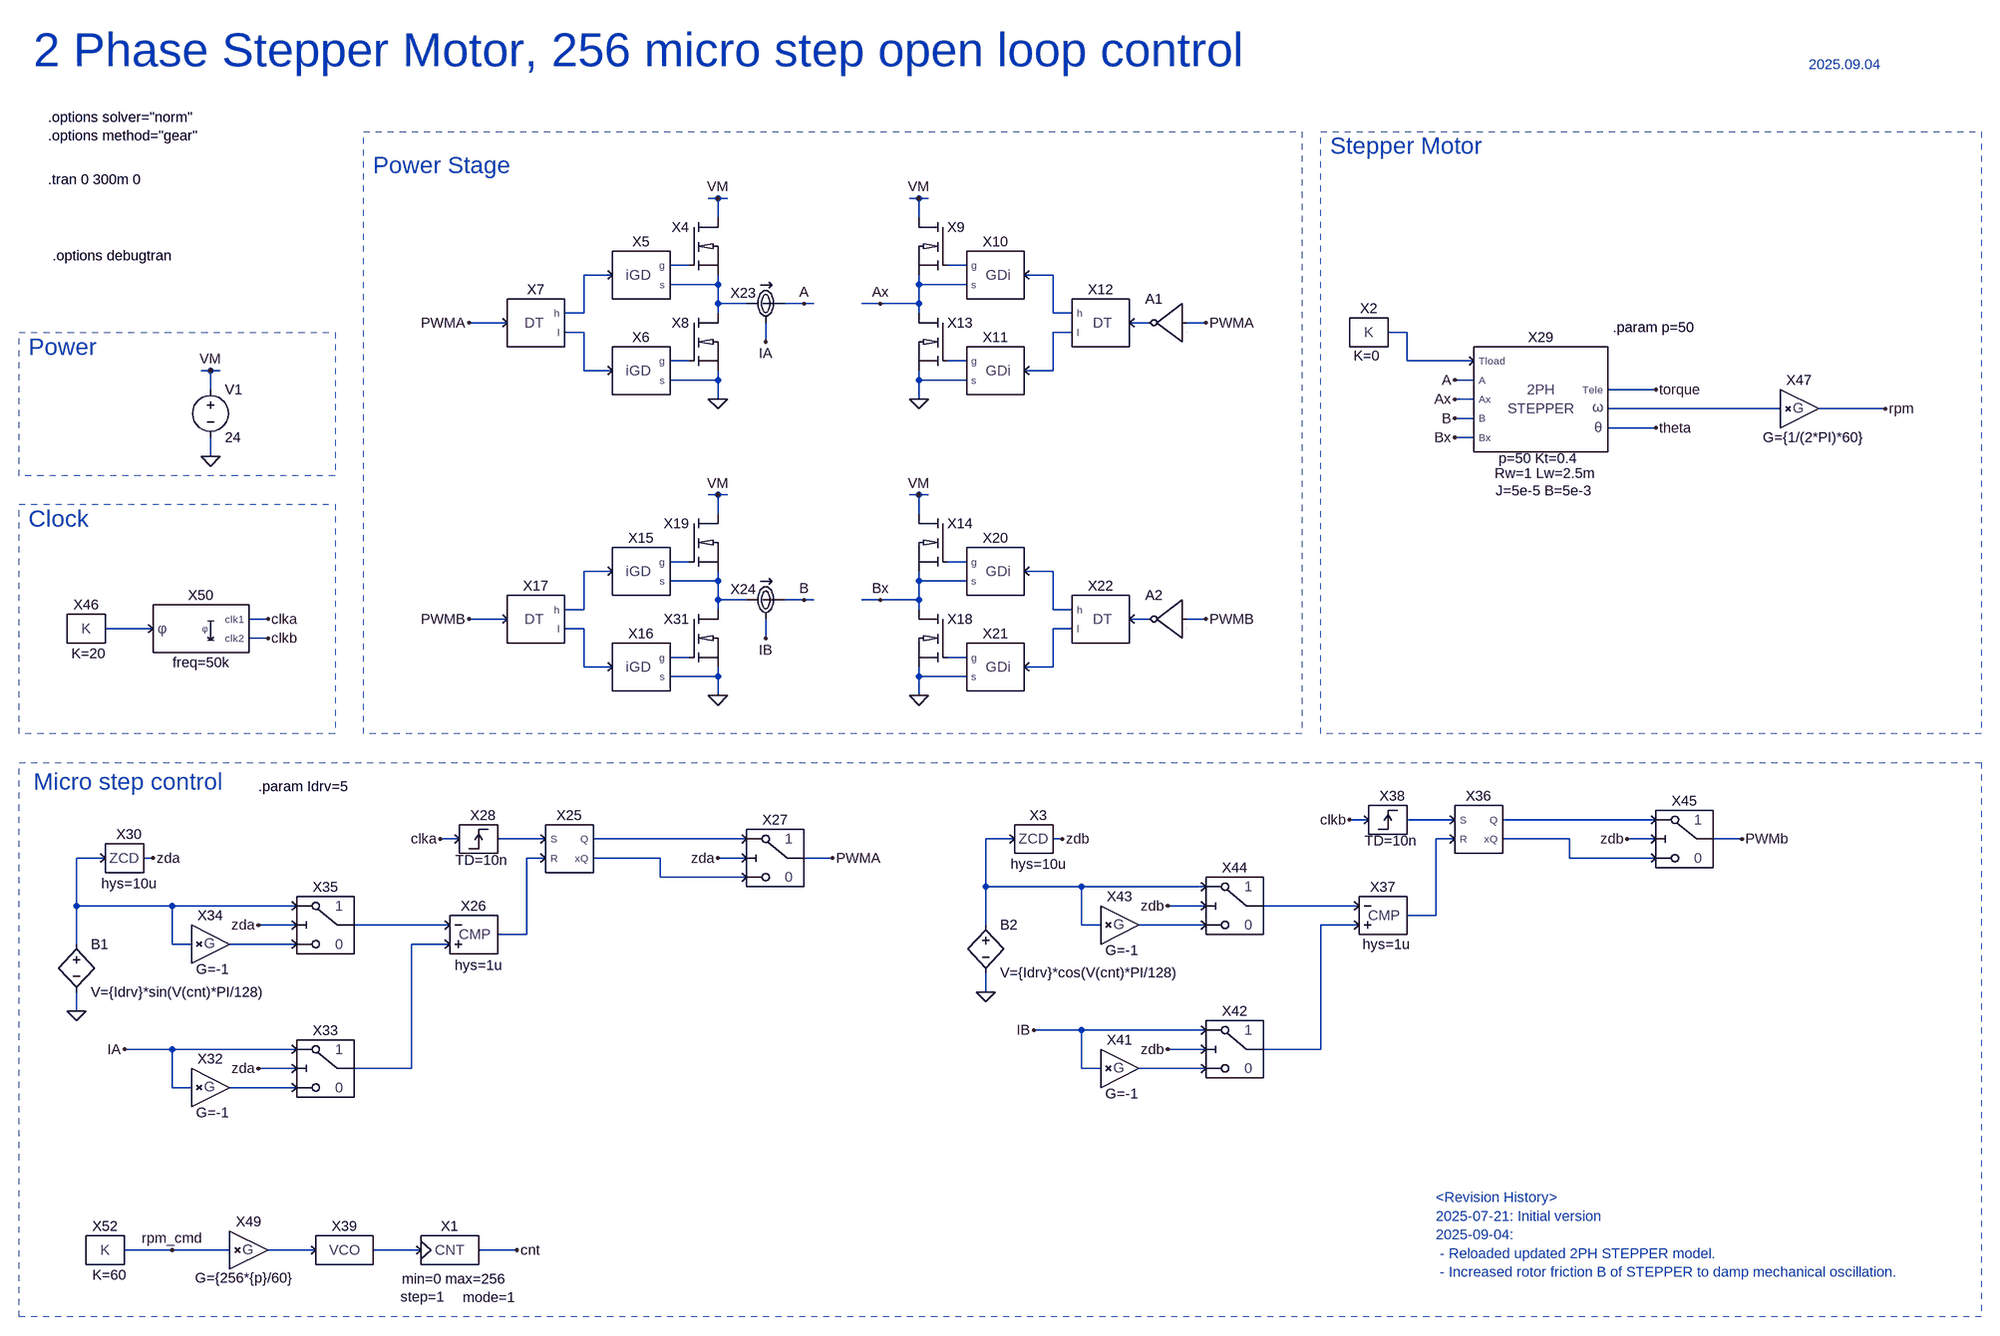
[diagram p0: schematic STEP2PH_uSTEP.asc]
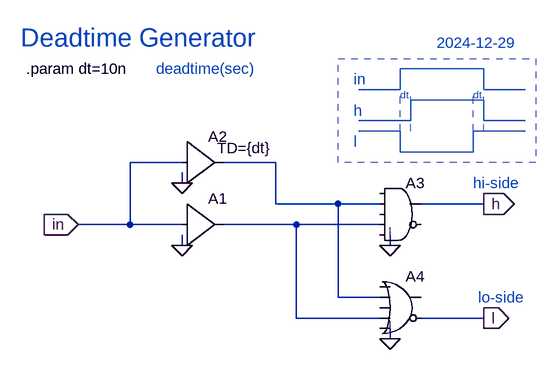
[diagram p1: sub-circuit deadtime.asc]
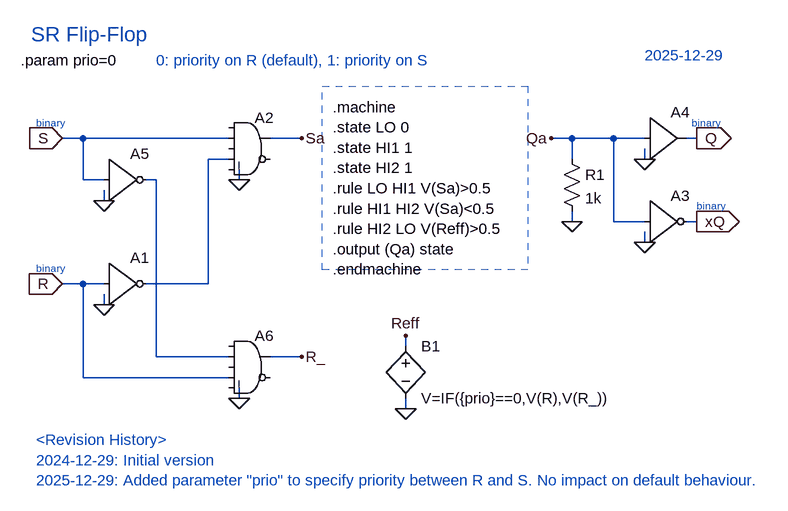
[diagram p2: sub-circuit srff.asc]
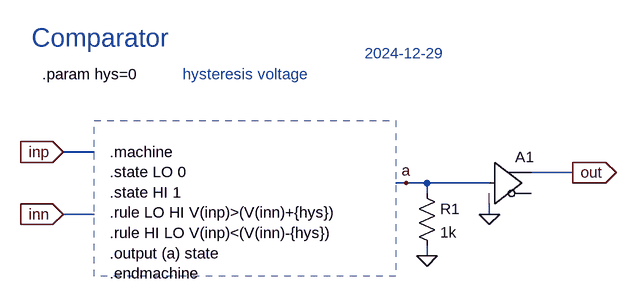
[diagram p3: sub-circuit cmp.asc]
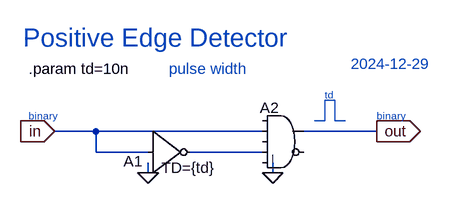
[diagram p4: sub-circuit posedge.asc]
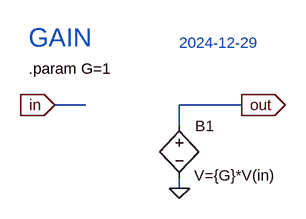
[diagram p5: sub-circuit gain.asc]
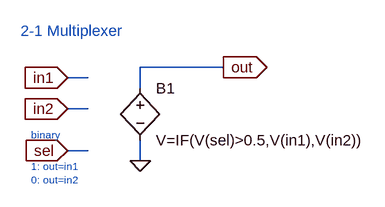
[diagram p6: sub-circuit mux.asc]
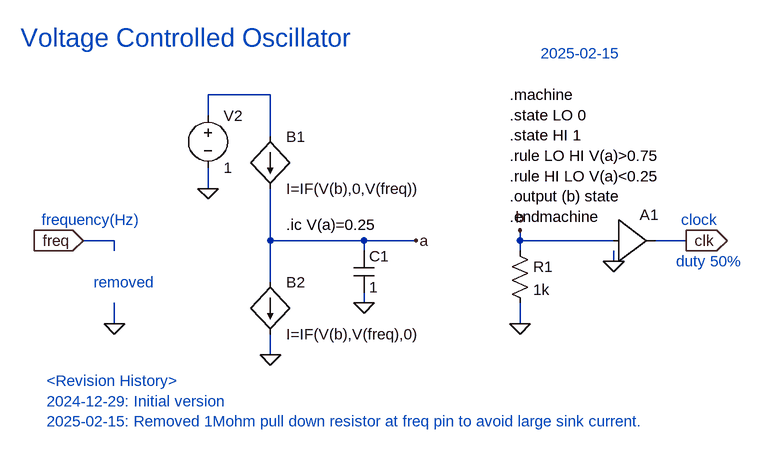
[diagram p7: sub-circuit vco.asc]
STEP2PH_uSTEP.asc, the LTspice schematic file:
Version 4.1
SHEET 1 1956 2284
WIRE -624 128 -640 128
WIRE -608 128 -624 128
WIRE -288 128 -304 128
WIRE -272 128 -288 128
WIRE -624 160 -624 128
WIRE -288 160 -288 128
WIRE -672 240 -704 240
WIRE -208 240 -240 240
WIRE -800 256 -848 256
WIRE -64 256 -112 256
WIRE -624 272 -624 256
WIRE -624 272 -704 272
WIRE -288 272 -288 256
WIRE -208 272 -288 272
WIRE -624 304 -624 272
WIRE -576 304 -624 304
WIRE -480 304 -512 304
WIRE -464 304 -480 304
WIRE -352 304 -384 304
WIRE -288 304 -288 272
WIRE -288 304 -352 304
WIRE -848 320 -848 256
WIRE -848 320 -880 320
WIRE -624 320 -624 304
WIRE -288 320 -288 304
WIRE -64 320 -64 256
WIRE -32 320 -64 320
WIRE -976 336 -1040 336
WIRE 96 336 64 336
WIRE 192 336 160 336
WIRE -848 352 -880 352
WIRE -32 352 -64 352
WIRE 528 352 496 352
WIRE -544 368 -544 336
WIRE -672 400 -704 400
WIRE -208 400 -240 400
WIRE 528 400 528 352
WIRE 640 400 528 400
WIRE -1472 416 -1488 416
WIRE -1456 416 -1472 416
WIRE -848 416 -848 352
WIRE -800 416 -848 416
WIRE -64 416 -64 352
WIRE -64 416 -112 416
WIRE -624 432 -624 416
WIRE -624 432 -704 432
WIRE -288 432 -288 416
WIRE -208 432 -288 432
WIRE 640 432 608 432
WIRE -1472 448 -1472 416
WIRE 944 448 864 448
WIRE -624 464 -624 432
WIRE -288 464 -288 432
WIRE 640 464 608 464
WIRE 1152 480 864 480
WIRE 1328 480 1216 480
WIRE 640 496 608 496
WIRE 944 512 864 512
WIRE 640 528 608 528
WIRE -1472 560 -1472 528
WIRE -624 624 -640 624
WIRE -608 624 -624 624
WIRE -288 624 -304 624
WIRE -272 624 -288 624
WIRE -624 656 -624 624
WIRE -288 656 -288 624
WIRE -672 736 -704 736
WIRE -208 736 -240 736
WIRE -800 752 -848 752
WIRE -64 752 -112 752
WIRE -624 768 -624 752
WIRE -624 768 -704 768
WIRE -288 768 -288 752
WIRE -208 768 -288 768
WIRE -624 800 -624 768
WIRE -576 800 -624 800
WIRE -480 800 -512 800
WIRE -464 800 -480 800
WIRE -352 800 -384 800
WIRE -288 800 -288 768
WIRE -288 800 -352 800
WIRE -848 816 -848 752
WIRE -848 816 -880 816
WIRE -624 816 -624 800
WIRE -288 816 -288 800
WIRE -64 816 -64 752
WIRE -32 816 -64 816
WIRE -1376 832 -1408 832
WIRE -976 832 -1040 832
WIRE 96 832 64 832
WIRE 192 832 160 832
WIRE -1568 848 -1648 848
WIRE -848 848 -880 848
WIRE -32 848 -64 848
WIRE -1376 864 -1408 864
WIRE -544 864 -544 832
WIRE -672 896 -704 896
WIRE -208 896 -240 896
WIRE -848 912 -848 848
WIRE -800 912 -848 912
WIRE -64 912 -64 848
WIRE -64 912 -112 912
WIRE -624 928 -624 912
WIRE -624 928 -704 928
WIRE -288 928 -288 912
WIRE -208 928 -288 928
WIRE -624 960 -624 928
WIRE -288 960 -288 928
WIRE 464 1168 432 1168
WIRE 608 1168 528 1168
WIRE 944 1168 688 1168
WIRE -1056 1200 -1088 1200
WIRE -912 1200 -992 1200
WIRE -576 1200 -832 1200
WIRE -128 1200 -176 1200
WIRE -48 1200 -64 1200
WIRE 608 1200 576 1200
WIRE 800 1200 688 1200
WIRE 944 1200 896 1200
WIRE 1088 1200 1040 1200
WIRE -1648 1232 -1696 1232
WIRE -1568 1232 -1584 1232
WIRE -912 1232 -944 1232
WIRE -720 1232 -832 1232
WIRE -576 1232 -624 1232
WIRE -432 1232 -480 1232
WIRE 800 1232 800 1200
WIRE 944 1232 800 1232
WIRE -720 1264 -720 1232
WIRE -576 1264 -720 1264
WIRE -176 1280 -176 1200
WIRE -16 1280 -176 1280
WIRE 192 1280 -16 1280
WIRE -1696 1312 -1696 1232
WIRE -1536 1312 -1696 1312
WIRE -1328 1312 -1536 1312
WIRE 192 1312 128 1312
WIRE 448 1312 288 1312
WIRE 576 1328 576 1200
WIRE 576 1328 528 1328
WIRE -1328 1344 -1392 1344
WIRE -1072 1344 -1232 1344
WIRE -176 1344 -176 1280
WIRE -16 1344 -16 1280
WIRE 16 1344 -16 1344
WIRE 192 1344 80 1344
WIRE 448 1344 384 1344
WIRE -944 1360 -944 1232
WIRE -944 1360 -992 1360
WIRE -1696 1376 -1696 1312
WIRE -1536 1376 -1536 1312
WIRE -1504 1376 -1536 1376
WIRE -1328 1376 -1440 1376
WIRE -1072 1376 -1136 1376
WIRE -176 1456 -176 1424
WIRE -1696 1488 -1696 1456
WIRE -16 1520 -96 1520
WIRE 192 1520 -16 1520
WIRE -1536 1552 -1616 1552
WIRE -1328 1552 -1536 1552
WIRE 192 1552 128 1552
WIRE 384 1552 384 1344
WIRE 384 1552 288 1552
WIRE -1328 1584 -1392 1584
WIRE -1136 1584 -1136 1376
WIRE -1136 1584 -1232 1584
WIRE -16 1584 -16 1520
WIRE 16 1584 -16 1584
WIRE 192 1584 80 1584
WIRE -1536 1616 -1536 1552
WIRE -1504 1616 -1536 1616
WIRE -1328 1616 -1440 1616
WIRE -1536 1888 -1616 1888
WIRE -1440 1888 -1536 1888
WIRE -1296 1888 -1376 1888
WIRE -1120 1888 -1200 1888
WIRE -960 1888 -1024 1888
FLAG 944 512 theta
FLAG -624 464 0
FLAG -480 304 A
FLAG 608 464 Ax
FLAG 608 528 Bx
FLAG -624 128 VM
FLAG -288 464 0
FLAG -352 304 Ax
FLAG -288 128 VM
FLAG -1040 336 PWMA
FLAG 192 336 PWMA
FLAG 944 448 torque
FLAG -624 960 0
FLAG -480 800 B
FLAG -624 624 VM
FLAG -288 960 0
FLAG -352 800 Bx
FLAG -288 624 VM
FLAG -1040 832 PWMB
FLAG 192 832 PWMB
FLAG -1472 560 0
FLAG -1472 416 VM
FLAG -544 368 IA
FLAG -544 864 IB
FLAG -1696 1488 0
FLAG -432 1232 PWMA
FLAG -1568 1232 zda
FLAG -1616 1552 IA
FLAG -1392 1584 zda
FLAG -1392 1344 zda
FLAG -1376 832 clka
FLAG -1088 1200 clka
FLAG -624 1232 zda
FLAG -176 1456 0
FLAG 1088 1200 PWMb
FLAG -48 1200 zdb
FLAG -96 1520 IB
FLAG 128 1552 zdb
FLAG 128 1312 zdb
FLAG 432 1168 clkb
FLAG 896 1200 zdb
FLAG -1376 864 clkb
FLAG -960 1888 cnt
FLAG 608 432 A
FLAG 608 496 B
FLAG -1536 1888 rpm_cmd
FLAG 1328 480 rpm
SYMBOL CONST 464 352 R0
WINDOW 39 -3 55 Bottom 2
SYMATTR SpiceLine K=0
SYMATTR InstName X2
SYMBOL iGD -752 256 R0
SYMATTR InstName X5
SYMBOL iGD -752 416 R0
SYMATTR InstName X6
SYMBOL DEADTIME -928 336 R0
SYMATTR InstName X7
SYMBOL iGD -160 256 M0
SYMATTR InstName X10
SYMBOL iGD -160 416 M0
SYMATTR InstName X11
SYMBOL DEADTIME 16 336 M0
SYMATTR InstName X12
SYMBOL Digital\\inv 160 272 M0
WINDOW 3 -21 103 Left 2
SYMATTR InstName A1
SYMBOL iGD -752 752 R0
SYMATTR InstName X15
SYMBOL iGD -752 912 R0
SYMATTR InstName X16
SYMBOL DEADTIME -928 832 R0
SYMATTR InstName X17
SYMBOL iGD -160 752 M0
SYMATTR InstName X20
SYMBOL iGD -160 912 M0
SYMATTR InstName X21
SYMBOL DEADTIME 16 832 M0
SYMATTR InstName X22
SYMBOL voltage -1472 432 R0
SYMATTR InstName V1
SYMATTR Value 24
SYMBOL IMON -544 304 R0
SYMATTR InstName X23
SYMBOL IMON -544 800 R0
SYMATTR InstName X24
SYMBOL SRFF -880 1216 R0
SYMATTR InstName X25
SYMBOL CMP -1024 1360 R0
WINDOW 39 0 67 Bottom 2
SYMATTR SpiceLine hys=1u
SYMATTR InstName X26
SYMBOL POSEDGE -1024 1200 R0
WINDOW 39 5 51 Bottom 2
SYMATTR SpiceLine TD=10n
SYMATTR InstName X28
SYMBOL GAIN -1472 1616 R0
WINDOW 39 3 58 Bottom 2
SYMATTR SpiceLine G=-1
SYMATTR InstName X32
SYMBOL MUX -1280 1584 R0
SYMATTR InstName X33
SYMBOL GAIN -1472 1376 R0
WINDOW 39 3 58 Bottom 2
SYMATTR SpiceLine G=-1
SYMATTR InstName X34
SYMBOL MUX -1280 1344 R0
SYMATTR InstName X35
SYMBOL MUX -528 1232 R0
SYMATTR InstName X27
SYMBOL SRFF 640 1184 R0
SYMATTR InstName X36
SYMBOL CMP 496 1328 R0
WINDOW 39 -3 64 Bottom 2
SYMATTR SpiceLine hys=1u
SYMATTR InstName X37
SYMBOL POSEDGE 496 1168 R0
WINDOW 39 5 51 Bottom 2
SYMATTR SpiceLine TD=10n
SYMATTR InstName X38
SYMBOL GAIN 48 1584 R0
WINDOW 39 3 58 Bottom 2
SYMATTR SpiceLine G=-1
SYMATTR InstName X41
SYMBOL MUX 240 1552 R0
SYMATTR InstName X42
SYMBOL GAIN 48 1344 R0
WINDOW 39 3 58 Bottom 2
SYMATTR SpiceLine G=-1
SYMATTR InstName X43
SYMBOL MUX 240 1312 R0
SYMATTR InstName X44
SYMBOL MUX 992 1200 R0
SYMATTR InstName X45
SYMBOL CONST -1680 848 R0
WINDOW 39 4 57 Bottom 2
SYMATTR SpiceLine K=20
SYMATTR InstName X46
SYMBOL bv -1696 1360 R0
SYMATTR InstName B1
SYMATTR Value V={Idrv}*sin(V(cnt)*PI/128)
SYMBOL bv -176 1328 R0
SYMATTR InstName B2
SYMATTR Value V={Idrv}*cos(V(cnt)*PI/128)
SYMBOL CONST -1648 1888 R0
WINDOW 39 7 57 Bottom 2
SYMATTR SpiceLine K=60
SYMATTR InstName X52
SYMBOL Digital\\inv 160 768 M0
WINDOW 3 -21 103 Left 2
SYMATTR InstName A2
SYMBOL VCO -1248 1888 R0
SYMATTR InstName X39
SYMBOL COUNTER -1072 1888 R0
WINDOW 123 7 64 Bottom 2
WINDOW 39 -46 94 Bottom 2
WINDOW 40 66 95 Bottom 2
SYMATTR InstName X1
SYMBOL GAIN 1184 480 R0
WINDOW 39 23 64 Bottom 2
SYMATTR SpiceLine G={1/(2*PI)*60}
SYMATTR InstName X47
SYMBOL GAIN -1408 1888 R0
WINDOW 39 -8 62 Bottom 2
SYMATTR SpiceLine G={256*{p}/60}
SYMATTR InstName X49
SYMBOL PHASESHIFT -1488 848 R0
WINDOW 39 0 72 Bottom 2
SYMATTR SpiceLine freq=50k
SYMATTR InstName X50
SYMBOL ZCD -1616 1232 R0
WINDOW 39 8 58 Bottom 2
SYMATTR SpiceLine hys=10u
SYMATTR InstName X30
SYMBOL ZCD -96 1200 R0
WINDOW 39 8 58 Bottom 2
SYMATTR SpiceLine hys=10u
SYMATTR InstName X3
SYMBOL iNMOS -624 208 R0
SYMATTR InstName X4
SYMBOL iNMOS -624 368 R0
SYMATTR InstName X8
SYMBOL iNMOS -288 208 M0
SYMATTR InstName X9
SYMBOL iNMOS -288 368 M0
SYMATTR InstName X13
SYMBOL iNMOS -288 704 M0
SYMATTR InstName X14
SYMBOL iNMOS -288 864 M0
SYMATTR InstName X18
SYMBOL iNMOS -624 704 R0
SYMATTR InstName X19
SYMBOL iNMOS -624 864 R0
SYMATTR InstName X31
SYMBOL STEPPER_2PH 752 464 R0
WINDOW 3 -5 115 Bottom 2
WINDOW 123 7 140 Bottom 2
WINDOW 39 5 169 Bottom 2
SYMATTR SpiceLine J=5e-5 B=5e-3
SYMATTR InstName X29
TEXT -1744 96 Left 2 !.tran 0 300m 0
TEXT -1744 -8 Left 2 !.options solver="norm"\n.options method="gear"
TEXT -1392 1112 Left 2 !.param Idrv=5
TEXT -1736 224 Left 2 !.options debugtran
TEXT 872 344 Left 2 !.param p=50
TEXT -1768 -120 Left 6 ;2 Phase Stepper Motor, 256 micro step open loop control
TEXT 400 40 Left 4 ;Stepper Motor
TEXT 1200 -96 Left 2 ;2025.09.04
TEXT -1200 72 Left 4 ;Power Stage
TEXT -1776 664 Left 4 ;Clock
TEXT -1776 376 Left 4 ;Power
TEXT -1768 1104 Left 4 ;Micro step control
TEXT 576 1800 Left 2 ;<Revision History>\n2025-07-21: Initial version\n2025-09-04: \n - Reloaded updated 2PH STEPPER model.\n - Increased rotor friction B of STEPPER to damp mechanical oscillation.
RECTANGLE Normal 352 1024 -1216 16 2
RECTANGLE Normal -1264 1024 -1792 640 2
RECTANGLE Normal 1488 1024 384 16 2
RECTANGLE Normal -1264 592 -1792 352 2
RECTANGLE Normal 1488 2000 -1792 1072 2

deadtime.asc, the sub-circuit schematic file:
Version 4
SHEET 1 1412 1312
WIRE 64 288 -16 288
WIRE 208 288 128 288
WIRE 64 320 64 304
WIRE 208 352 208 288
WIRE 304 352 208 352
WIRE 368 352 304 352
WIRE 528 352 432 352
WIRE -16 384 -16 288
WIRE -16 384 -96 384
WIRE 64 384 -16 384
WIRE 240 384 128 384
WIRE 368 384 240 384
WIRE 64 416 64 400
WIRE 384 416 384 400
WIRE 304 496 304 352
WIRE 368 496 304 496
WIRE 240 528 240 384
WIRE 368 528 240 528
WIRE 528 528 432 528
WIRE 384 560 384 544
FLAG -96 384 in
IOPIN -96 384 In
FLAG 64 416 0
FLAG 64 320 0
FLAG 384 416 0
FLAG 384 560 0
FLAG 528 352 h
IOPIN 528 352 Out
FLAG 528 528 l
IOPIN 528 528 Out
SYMBOL Digital\\buf1 64 320 R0
SYMATTR InstName A1
SYMBOL Digital\\buf1 64 224 R0
WINDOW 3 54 42 Left 2
SYMATTR Value TD={dt}
SYMATTR InstName A2
SYMBOL Digital\\and 400 304 R0
SYMATTR InstName A3
SYMBOL Digital\\or 400 448 R0
SYMATTR InstName A4
TEXT -176 144 Left 2 !.param dt=10n
TEXT -184 96 Left 4 ;Deadtime Generator
TEXT 24 144 Left 2 ;deadtime(sec)
TEXT 512 320 Left 2 ;hi-side
TEXT 520 496 Left 2 ;lo-side
TEXT 328 160 Left 2 ;in
TEXT 328 208 Left 2 ;h
TEXT 328 256 Left 2 ;l
TEXT 400 184 Left 1 ;dt
TEXT 512 184 Left 1 ;dt
TEXT 456 104 Left 2 ;2024-12-29
LINE Normal 400 176 336 176
LINE Normal 400 176 400 144
LINE Normal 528 144 400 144
LINE Normal 528 176 528 144
LINE Normal 592 176 528 176
LINE Normal 416 224 336 224
LINE Normal 416 224 416 192
LINE Normal 528 192 416 192
LINE Normal 528 224 528 192
LINE Normal 592 224 528 224
LINE Normal 400 240 336 240
LINE Normal 400 272 400 240
LINE Normal 512 272 400 272
LINE Normal 512 272 512 240
LINE Normal 592 240 512 240
LINE Normal 400 240 400 176 2
LINE Normal 512 240 512 176 2
LINE Normal 416 240 416 176 2
LINE Normal 528 240 528 176 2
RECTANGLE Normal 608 288 304 128 2

srff.asc, the sub-circuit schematic file:
Version 4.1
SHEET 1 928 680
WIRE -272 -496 -304 -496
WIRE -48 -496 -272 -496
WIRE 64 -496 16 -496
WIRE 480 -496 448 -496
WIRE 544 -496 480 -496
WIRE 592 -496 544 -496
WIRE 672 -496 656 -496
WIRE -48 -464 -80 -464
WIRE 480 -464 480 -496
WIRE 592 -464 592 -480
WIRE -272 -432 -272 -496
WIRE -240 -432 -272 -432
WIRE -160 -432 -176 -432
WIRE -32 -432 -32 -448
WIRE -240 -400 -240 -416
WIRE 480 -368 480 -384
WIRE 544 -368 544 -496
WIRE 592 -368 544 -368
WIRE 672 -368 656 -368
WIRE 592 -336 592 -352
WIRE -272 -272 -304 -272
WIRE -240 -272 -272 -272
WIRE -80 -272 -80 -464
WIRE -80 -272 -176 -272
WIRE -240 -240 -240 -256
WIRE 224 -176 224 -192
WIRE -160 -160 -160 -432
WIRE -48 -160 -160 -160
WIRE 64 -160 16 -160
WIRE -272 -128 -272 -272
WIRE -48 -128 -272 -128
WIRE -32 -96 -32 -112
WIRE 224 -80 224 -96
FLAG -304 -496 S
IOPIN -304 -496 In
FLAG -304 -272 R
IOPIN -304 -272 In
FLAG -240 -240 0
FLAG -32 -432 0
FLAG 64 -496 Sa
FLAG 592 -336 0
FLAG 672 -496 Q
IOPIN 672 -496 Out
FLAG 672 -368 xQ
IOPIN 672 -368 Out
FLAG 592 -464 0
FLAG 448 -496 Qa
FLAG 480 -368 0
FLAG 224 -80 0
FLAG 224 -192 Reff
FLAG -240 -400 0
FLAG -32 -96 0
FLAG 64 -160 R_
SYMBOL Digital\\inv -240 -336 R0
SYMATTR InstName A1
SYMBOL Digital\\and -16 -544 R0
SYMATTR InstName A2
SYMBOL Digital\\inv 592 -432 R0
SYMATTR InstName A3
SYMBOL Digital\\buf1 592 -560 R0
SYMATTR InstName A4
SYMBOL res 464 -480 R0
SYMATTR InstName R1
SYMATTR Value 1k
SYMBOL bv 224 -192 R0
SYMATTR InstName B1
SYMATTR Value V=IF({prio}==0,V(R),V(R_))
SYMBOL Digital\\inv -240 -496 R0
SYMATTR InstName A5
SYMBOL Digital\\and -16 -208 R0
SYMATTR InstName A6
TEXT 112 -544 Left 2 !.machine\n.state LO 0\n.state HI1 1\n.state HI2 1\n.rule LO HI1 V(Sa)>0.5\n.rule HI1 HI2 V(Sa)<0.5\n.rule HI2 LO V(Reff)>0.5\n.output (Qa) state\n.endmachine
TEXT -352 -656 Left 3 ;SR Flip-Flop
TEXT -344 -520 Left 1 ;binary
TEXT -344 -296 Left 1 ;binary
TEXT 664 -520 Left 1 ;binary
TEXT 672 -392 Left 1 ;binary
TEXT 592 -624 Left 2 ;2025-12-29
TEXT -368 -616 Left 2 !.param prio=0
TEXT -160 -616 Left 2 ;0: priority on R (default), 1: priority on S
TEXT -344 -32 Left 2 ;<Revision History>\n2024-12-29: Initial version\n2025-12-29: Added parameter "prio" to specify priority between R and S. No impact on default behaviour.
RECTANGLE Normal 412 -294 96 -576 2

cmp.asc, the sub-circuit schematic file:
Version 4
SHEET 1 1276 680
WIRE 352 96 304 96
WIRE 1088 128 1024 128
WIRE 832 144 816 144
WIRE 864 144 832 144
WIRE 960 144 864 144
WIRE 864 160 864 144
WIRE 352 192 304 192
WIRE 960 192 960 176
WIRE 864 256 864 240
FLAG 304 96 inp
IOPIN 304 96 In
FLAG 304 192 inn
IOPIN 304 192 In
FLAG 1088 128 out
IOPIN 1088 128 Out
FLAG 864 256 0
FLAG 832 144 a
FLAG 960 192 0
SYMBOL res 848 144 R0
SYMATTR InstName R1
SYMATTR Value 1k
SYMBOL Digital\\buf 960 80 R0
SYMATTR InstName A1
TEXT 376 96 Left 2 !.machine\n.state LO 0\n.state HI 1\n.rule LO HI V(inp)>(V(inn)+{hys})\n.rule HI LO V(inp)<(V(inn)-{hys})\n.output (a) state\n.endmachine
TEXT 272 -24 Left 2 !.param hys=0
TEXT 256 -80 Left 4 ;Comparator
TEXT 488 -24 Left 2 ;hysteresis voltage
TEXT 768 -56 Left 2 ;2024-12-29
RECTANGLE Normal 816 288 352 48 2

posedge.asc, the sub-circuit schematic file:
Version 4
SHEET 1 880 680
WIRE 192 160 128 160
WIRE 448 160 192 160
WIRE 624 160 512 160
WIRE 192 192 192 160
WIRE 272 192 192 192
WIRE 448 192 336 192
WIRE 272 224 272 208
WIRE 464 224 464 208
FLAG 128 160 in
IOPIN 128 160 In
FLAG 464 224 0
FLAG 624 160 out
IOPIN 624 160 Out
FLAG 272 224 0
SYMBOL Digital\\and 480 112 R0
WINDOW 0 -36 12 Left 2
SYMATTR InstName A2
SYMBOL Digital\\inv 272 128 R0
WINDOW 3 21 88 Left 2
WINDOW 0 -38 78 Left 2
SYMATTR Value TD={td}
SYMATTR InstName A1
TEXT 88 64 Left 2 !.param td=10n
TEXT 80 16 Left 4 ;Positive Edge Detector
TEXT 88 136 Left 1 ;binary
TEXT 624 136 Left 1 ;binary
TEXT 544 104 Left 1 ;td
TEXT 304 64 Left 2 ;pulse width
TEXT 584 56 Left 2 ;2024-12-29
LINE Normal 544 144 528 144
LINE Normal 544 144 544 112
LINE Normal 560 144 560 112
LINE Normal 576 144 560 144
LINE Normal 544 112 560 112

gain.asc, the sub-circuit schematic file:
Version 4
SHEET 1 880 680
WIRE 0 64 -48 64
WIRE 240 64 144 64
WIRE 144 96 144 64
WIRE 144 192 144 176
FLAG 144 192 0
FLAG 240 64 out
IOPIN 240 64 Out
FLAG -48 64 in
IOPIN -48 64 In
SYMBOL bv 144 80 R0
WINDOW 3 23 92 Left 2
SYMATTR Value V={G}*V(in)
SYMATTR InstName B1
TEXT -88 8 Left 2 !.param G=1
TEXT -88 -40 Left 4 ;GAIN
TEXT 144 -32 Left 2 ;2024-12-29

mux.asc, the sub-circuit schematic file:
Version 4
SHEET 1 880 680
WIRE 336 16 208 16
WIRE 128 32 96 32
WIRE 208 48 208 16
WIRE 128 80 96 80
WIRE 128 144 96 144
WIRE 208 160 208 128
FLAG 96 32 in1
IOPIN 96 32 In
FLAG 96 80 in2
IOPIN 96 80 In
FLAG 96 144 sel
IOPIN 96 144 In
FLAG 336 16 out
IOPIN 336 16 Out
FLAG 208 160 0
SYMBOL bv 208 32 R0
SYMATTR InstName B1
SYMATTR Value V=IF(V(sel)>0.5,V(in1),V(in2))
TEXT 24 -40 Left 2 ;2-1 Multiplexer
TEXT 40 120 Left 1 ;binary
TEXT 40 168 Left 1 ;1: out=in1\n0: out=in2

vco.asc, the sub-circuit schematic file:
Version 4
SHEET 1 1132 680
WIRE 176 -176 80 -176
WIRE 80 -144 80 -176
WIRE 176 -112 176 -176
WIRE 80 -32 80 -64
WIRE -64 48 -112 48
WIRE 176 48 176 -32
WIRE 320 48 176 48
WIRE 400 48 320 48
WIRE 560 48 560 32
WIRE 704 48 560 48
WIRE 816 48 768 48
WIRE -64 64 -64 48
WIRE 320 64 320 48
WIRE 560 64 560 48
WIRE 704 80 704 64
WIRE 176 112 176 48
WIRE 320 144 320 128
WIRE -64 176 -64 144
WIRE 560 176 560 144
WIRE 176 224 176 192
FLAG 320 144 0
FLAG 560 176 0
FLAG 176 224 0
FLAG 80 -32 0
FLAG 400 48 a
FLAG 560 32 b
FLAG 704 80 0
FLAG 816 48 clk
IOPIN 816 48 Out
FLAG -112 48 freq
IOPIN -112 48 In
FLAG -64 176 0
SYMBOL cap 304 64 R0
SYMATTR InstName C1
SYMATTR Value 1
SYMBOL res 544 48 R0
SYMATTR InstName R1
SYMATTR Value 1k
SYMBOL voltage 80 -160 R0
WINDOW 123 0 0 Left 0
WINDOW 39 0 0 Left 0
SYMATTR InstName V2
SYMATTR Value 1
SYMBOL bi 176 112 R0
SYMATTR InstName B2
SYMATTR Value I=IF(V(b),V(freq),0)
SYMBOL bi 176 -112 R0
SYMATTR InstName B1
SYMATTR Value I=IF(V(b),0,V(freq))
SYMBOL Digital\\buf1 704 -16 R0
SYMATTR InstName A1
TEXT 544 -176 Left 2 !.machine\n.state LO 0\n.state HI 1\n.rule LO HI V(a)>0.75\n.rule HI LO V(a)<0.25\n.output (b) state\n.endmachine
TEXT 200 24 Left 2 !.ic V(a)=0.25
TEXT -208 -264 Left 4 ;Voltage Controlled Oscillator
TEXT -176 16 Left 2 ;frequency(Hz)
TEXT 808 16 Left 2 ;clock
TEXT 800 80 Left 2 ;duty 50%
TEXT 592 -240 Left 2 ;2025-02-15
TEXT -168 264 Left 2 ;<Revision History>\n2024-12-29: Initial version\n2025-02-15: Removed 1Mohm pull down resistor at freq pin to avoid large sink current.
TEXT -96 112 Left 2 ;removed

counter.asc, the sub-circuit schematic file:
Version 4.1
SHEET 1 2588 2296
WIRE 160 304 112 304
WIRE 160 352 160 304
WIRE 208 352 160 352
WIRE 1088 368 448 368
WIRE -64 384 -112 384
WIRE 208 384 16 384
WIRE 352 384 304 384
WIRE -64 416 -208 416
WIRE 208 416 160 416
WIRE 160 464 160 416
WIRE 160 464 112 464
WIRE 352 480 352 384
WIRE 448 480 448 368
WIRE 320 512 272 512
WIRE 416 512 384 512
WIRE 656 512 480 512
WIRE 656 544 496 544
WIRE 800 544 752 544
WIRE 656 576 624 576
WIRE -208 656 -208 416
WIRE 368 656 -208 656
WIRE 496 656 496 544
WIRE 496 656 448 656
WIRE 624 672 624 576
WIRE 624 672 608 672
WIRE -208 688 -208 656
WIRE 368 688 304 688
WIRE 800 688 800 544
WIRE 832 688 800 688
WIRE 832 720 656 720
WIRE 992 720 928 720
WIRE 1088 720 1088 368
WIRE 1088 720 1056 720
WIRE 1200 720 1088 720
WIRE 832 752 800 752
WIRE -112 784 -112 384
WIRE 224 784 -112 784
WIRE 304 784 304 688
WIRE 304 784 288 784
WIRE 800 800 800 752
WIRE 800 800 784 800
WIRE -208 816 -208 768
WIRE -112 816 -112 784
WIRE 224 816 192 816
WIRE 192 864 192 816
WIRE 192 864 160 864
WIRE -112 944 -112 896
WIRE 448 944 352 944
WIRE 656 944 656 720
WIRE 656 944 528 944
WIRE 448 976 416 976
WIRE 352 1056 352 944
WIRE 352 1056 -704 1056
WIRE 1024 1056 1024 752
WIRE 1024 1056 352 1056
FLAG -704 1056 CLK
IOPIN -704 1056 In
FLAG 1200 720 out
IOPIN 1200 720 Out
FLAG -208 816 0
FLAG -112 944 0
FLAG 416 976 0
SYMBOL SAMPLEHOLD 1024 720 R0
SYMATTR InstName X1
SYMBOL CONST 240 512 R0
WINDOW 39 -3 55 Bottom 2
SYMATTR SpiceLine K={step}
SYMATTR InstName X2
SYMBOL SUM 448 512 M180
SYMATTR InstName X3
SYMBOL MUX 704 544 R0
SYMATTR InstName X4
SYMBOL CONST 576 672 R0
WINDOW 39 -3 55 Bottom 2
SYMATTR SpiceLine K={min}
SYMATTR InstName X5
SYMBOL bv -208 672 M0
WINDOW 3 25 92 Left 2
SYMATTR Value V=IF(V(out)<{min+step}*0.999,1,0)
SYMATTR InstName B1
SYMBOL bv -112 800 R0
WINDOW 0 -48 14 Left 2
WINDOW 3 -386 87 Left 2
SYMATTR InstName B2
SYMATTR Value V=IF(V(out)>{max}*0.999,1,0)
SYMBOL MUX 256 384 R0
SYMATTR InstName X7
SYMBOL MUL 352 512 M180
SYMATTR InstName X8
SYMBOL CONST 80 304 R0
WINDOW 39 -3 55 Bottom 2
SYMATTR SpiceLine K=-1
SYMATTR InstName X9
SYMBOL CONST 80 464 R0
WINDOW 39 -3 55 Bottom 2
SYMATTR InstName X10
SYMBOL SRFF -32 400 R0
SYMATTR InstName X11
SYMBOL SRFF 400 672 R0
SYMATTR InstName X6
SYMBOL Digital\\and 256 736 R0
SYMATTR InstName A1
SYMBOL CONST 128 864 R0
WINDOW 39 -3 55 Bottom 2
SYMATTR SpiceLine K={mode}
SYMATTR InstName X12
SYMBOL MUX 880 720 R0
SYMATTR InstName X13
SYMBOL CONST 752 800 R0
WINDOW 39 -3 55 Bottom 2
SYMATTR SpiceLine K={init}
SYMATTR InstName X14
SYMBOL SRFF 480 960 R0
SYMATTR InstName X15
TEXT -760 80 Left 2 !.param init=0\n.param min=0\n.param max=256\n.param step=1\n.param mode=1
TEXT -768 8 Left 6 ;Counter
TEXT 1152 48 Left 2 ;2025-07-21
TEXT 1080 784 Left 2 !.ic V(out)={init}
TEXT -496 80 Left 2 ;initial Value\nmin value\nmax value\ninvrement\n1: loopback 0: reverse
TEXT -768 1016 Left 2 ;Clock
TEXT -744 1136 Left 2 ;<Revision History>\n2025-07-21: Initial version

samplehold.asc, the sub-circuit schematic file:
Version 4
SHEET 1 880 680
WIRE 576 -560 480 -560
WIRE -80 -512 -128 -512
WIRE 480 -512 480 -560
WIRE 368 -496 368 -528
WIRE -80 -448 -128 -448
WIRE 368 -400 368 -416
WIRE 480 -400 480 -432
FLAG -128 -512 IN
IOPIN -128 -512 In
FLAG -128 -448 CLK
IOPIN -128 -448 In
FLAG 576 -560 OUT
IOPIN 576 -560 Out
FLAG 368 -400 0
FLAG 368 -528 o
FLAG 480 -400 0
SYMBOL res 352 -512 R0
SYMATTR InstName R1
SYMATTR Value 1k
SYMBOL bv 480 -528 R0
SYMATTR InstName B1
SYMATTR Value V=V(o)
TEXT -248 -672 Left 3 ;Sample & Hold
TEXT -248 -448 Left 1 ;binary
TEXT 496 -656 Left 2 ;2025-3-23
TEXT -24 -544 Left 2 !.machine\n.state LO 0\n.state LATCH 1\n.state HI 2\n.rule LO LATCH V(clk)>.5\n.rule LATCH HI  V(clk)>.9\n.rule * LO V(clk)<.5\n.output (o) IF((state==1),V(in),V(out))  \n.endmachine

sum.asc, the sub-circuit schematic file:
Version 4
SHEET 1 880 680
WIRE 288 96 208 96
WIRE 208 112 208 96
WIRE 96 128 48 128
WIRE 96 176 48 176
WIRE 208 208 208 192
FLAG 48 128 IN1
IOPIN 48 128 In
FLAG 48 176 IN2
IOPIN 48 176 In
FLAG 208 208 0
FLAG 288 96 OUT
IOPIN 288 96 Out
SYMBOL bv 208 96 R0
SYMATTR InstName B1
SYMATTR Value V=V(IN1)+V(IN2)
TEXT -16 32 Left 4 ;SUM
TEXT 200 40 Left 2 ;2024-12-29

mul.asc, the sub-circuit schematic file:
Version 4
SHEET 1 880 680
WIRE 96 48 48 48
WIRE 320 48 240 48
WIRE 96 64 96 48
WIRE 240 64 240 48
WIRE 96 160 96 144
WIRE 240 160 240 144
WIRE 96 208 48 208
WIRE 96 224 96 208
WIRE 96 320 96 304
FLAG 48 48 IN1
IOPIN 48 48 In
FLAG 48 208 IN2
IOPIN 48 208 In
FLAG 240 160 0
FLAG 320 48 OUT
IOPIN 320 48 Out
FLAG 96 160 0
FLAG 96 320 0
SYMBOL bv 240 48 R0
SYMATTR InstName B1
SYMATTR Value V=V(IN1)*V(IN2)
SYMBOL res 80 48 R0
SYMATTR InstName R1
SYMATTR Value 1Meg
SYMBOL res 80 208 R0
SYMATTR InstName R2
SYMATTR Value 1Meg
TEXT -16 -56 Left 4 ;Multiplier

stepper_2ph.asc, the sub-circuit schematic file:
Version 4.1
SHEET 1 2756 2296
WIRE 1808 256 1712 256
WIRE 1712 304 1712 256
WIRE 1712 416 1712 384
WIRE 1808 496 1712 496
WIRE 1344 512 1264 512
WIRE 1712 544 1712 496
WIRE 48 640 -64 640
WIRE 192 640 128 640
WIRE 400 640 272 640
WIRE 1712 656 1712 624
WIRE 400 672 400 640
WIRE 2432 768 2272 768
WIRE 400 800 400 752
WIRE 400 800 -64 800
WIRE 2272 832 2272 768
WIRE 2432 864 2432 768
WIRE 1328 944 1216 944
WIRE 1472 944 1408 944
WIRE 1664 944 1552 944
WIRE 1856 944 1744 944
WIRE 64 960 -48 960
WIRE 208 960 144 960
WIRE 416 960 288 960
WIRE 2272 976 2272 912
WIRE 2432 976 2272 976
WIRE 416 992 416 960
WIRE 1216 992 1216 944
WIRE 1744 992 1744 944
WIRE 2272 1008 2272 976
WIRE 1216 1104 1216 1072
WIRE 1664 1104 1664 944
WIRE 1744 1104 1744 1072
WIRE 416 1120 416 1072
WIRE 416 1120 -48 1120
WIRE 2272 1120 2272 1072
FLAG 1712 656 0
FLAG 1216 1104 0
FLAG 2272 1120 0
FLAG 1264 512 Tload
IOPIN 1264 512 In
FLAG -64 640 A
IOPIN -64 640 BiDir
FLAG -64 800 Ax
IOPIN -64 800 BiDir
FLAG -48 960 B
IOPIN -48 960 BiDir
FLAG -48 1120 Bx
IOPIN -48 1120 BiDir
FLAG 2432 976 theta
IOPIN 2432 976 Out
FLAG 1808 496 Tcog
IOPIN 1808 496 Out
FLAG 1664 1104 0
FLAG 2432 864 0
FLAG 1712 416 0
FLAG 1808 256 Tele
IOPIN 1808 256 Out
FLAG 1744 1104 0
FLAG 1856 944 omega
IOPIN 1856 944 Out
SYMBOL res 144 624 R90
WINDOW 0 0 56 VBottom 2
WINDOW 3 32 56 VTop 2
SYMATTR InstName Ra
SYMATTR Value {Rw}
SYMBOL ind 176 656 R270
WINDOW 0 32 56 VTop 2
WINDOW 3 5 56 VBottom 2
SYMATTR InstName La
SYMATTR Value {Lw}
SYMBOL res 160 944 R90
WINDOW 0 0 56 VBottom 2
WINDOW 3 32 56 VTop 2
SYMATTR InstName Rb
SYMATTR Value {Rw}
SYMBOL ind 192 976 R270
WINDOW 0 32 56 VTop 2
WINDOW 3 5 56 VBottom 2
SYMATTR InstName Lb
SYMATTR Value {Lw}
SYMBOL bv 416 976 R0
WINDOW 3 41 53 Left 2
SYMATTR Value V={Kt*cos(p*V(theta))*V(omega)}
SYMATTR InstName B2
SYMBOL bv 1712 528 R0
SYMATTR InstName B3
SYMATTR Value V={cg1*Kt*sin(N*V(theta))+cg3*Kt*sin(3*N*V(theta))+cg5*Kt*sin(5*N*V(theta))}
SYMBOL ind 1456 960 R270
WINDOW 0 32 56 VTop 2
WINDOW 3 5 56 VBottom 2
SYMATTR InstName J
SYMATTR Value {J}
SYMBOL bv 1216 976 R0
SYMATTR InstName B5
SYMATTR Value V=V(Tele)-V(Tload)+V(Tcog)
SYMBOL cap 2256 1008 R0
SYMATTR InstName C1
SYMATTR Value 1
SYMBOL res 1424 928 R90
WINDOW 0 0 56 VBottom 2
WINDOW 3 32 56 VTop 2
SYMATTR InstName B
SYMATTR Value {B}
SYMBOL bi 2272 832 R0
SYMATTR InstName B4
SYMATTR Value I=V(omega)
SYMBOL bv 400 656 R0
WINDOW 3 41 53 Left 2
SYMATTR Value V={Kt*sin(p*V(theta))*V(omega)}
SYMATTR InstName B1
SYMBOL bv 1712 288 R0
SYMATTR InstName B6
SYMATTR Value V={Kt*I(La)*sin(p*V(theta))+Kt*I(Lb)*cos(p*V(theta))}
SYMBOL bv 1744 976 R0
SYMATTR InstName B7
SYMATTR Value V=I(J)
TEXT -104 144 Left 2 !.param p=50\n.param Rw=1\n.param Lw=2.5m\n.param J=5e-5\n.param B=5e-4\n.param Kt=0.4\n.param N=100\n.param cg1=0.01\n.param cg3=0.003\n.param cg5=0.001
TEXT -128 40 Left 6 ;Two Phase Hybrid Stepper Motor
TEXT 2440 56 Left 2 ;2025-09-04
TEXT 2384 1056 Left 2 !.ic V(theta)=0
TEXT 1480 832 Left 2 !.ic I(J)=0
TEXT 1480 880 Left 2 ;Inertia
TEXT 1328 880 Left 2 ;Friction
TEXT 288 496 Left 2 !.ic I(La)=0\n.ic I(Lb)=0
TEXT 120 144 Left 2 ;Number of rotor pole pairs\nWiding Resistance (ohm)\nWiding inductance (H)\nRotor Inertia (kg・m^2)\nRotor Friction (N・m・s/rad)\nTorque Constant (N・m/A)\nCogging per rotation (least common multiple of 2*p and number of stator slots)\n1st harmonic cogging torque ratio  (cogging torque amplitude divided by Kt)\n3rd harmonic cogging torque ratio  (cogging torque amplitude divided by Kt)\n5th harmonic cogging torque ratio  (cogging torque amplitude divided by Kt)
TEXT -120 1216 Left 2 ;<Revision History>\n2025-07-19: Initial version\n2025-09-04: \n  - Fixed mistake ini cogging torque formula.\n  - Replaced all IMON BV source.\n  - Reduced default cogging torque ration.
TEXT -144 480 Left 4 ;Electrical Domain
TEXT 1112 232 Left 4 ;Mechanical Domain
RECTANGLE Normal 1024 1184 -160 448 2
RECTANGLE Normal 2752 1184 1088 192 2

The netlist it stands for:
* STEP2PH_uSTEP.asc
X§X2 N009 CONST K=0  ; pins K
X§X5 N003 N001 N005 iGD  ; pins in g s
X§X6 N007 N010 0 iGD  ; pins in g s
X§X7 PWMA N007 N003 deadtime params: dt=10n
X§X10 N004 N002 Ax iGD  ; pins in g s
X§X11 N008 N011 0 iGD  ; pins in g s
X§X12 N006 N008 N004 deadtime params: dt=10n
A1 PWMA 0 0 0 0 N006 0 0 BUF
X§X15 N015 N013 N017 iGD  ; pins in g s
X§X16 N020 N022 0 iGD  ; pins in g s
X§X17 PWMB N020 N015 deadtime params: dt=10n
X§X20 N016 N014 Bx iGD  ; pins in g s
X§X21 N021 N023 0 iGD  ; pins in g s
X§X22 N018 N021 N016 deadtime params: dt=10n
V1 VM 0 24
X§X23 A IA N005 IMON rsns=10u  ; pins n out p
X§X24 B IB N017 IMON rsns=10u  ; pins n out p
X§X25 N032 N026 N027 N033 srff params: prio=0
X§X26 N035 N039 N032 cmp params: hys=1u
X§X28 clka N026 posedge params: TD=10n
X§X32 IA N041 gain params: G=-1
X§X33 IA N041 zda N039 mux
X§X34 N031 N038 gain params: G=-1
X§X35 N031 N038 zda N035 mux
X§X27 N027 N033 zda PWMA mux
X§X36 N029 N024 N025 N030 srff params: prio=0
X§X37 N034 N037 N029 cmp params: hys=1u
X§X38 clkb N024 posedge params: TD=10n
X§X41 IB N040 gain params: G=-1
X§X42 IB N040 zdb N037 mux
X§X43 N028 N036 gain params: G=-1
X§X44 N028 N036 zdb N034 mux
X§X45 N025 N030 zdb PWMB mux
X§X46 N019 CONST K=20  ; pins K
B1 N031 0 V={Idrv}*sin(V(cnt)*PI/128)
B2 N028 0 V={Idrv}*cos(V(cnt)*PI/128)
X§X52 rpm_cmd CONST K=60  ; pins K
A2 PWMB 0 0 0 0 N018 0 0 BUF
X§X39 N042 N043 vco
X§X1 N043 cnt counter params: init=0 min=0 max=256 step=1 mode=1
X§X47 N012 rpm gain params: G={1/(2*PI)*60}
X§X49 rpm_cmd N042 gain params: G={256*{p}/60}
X§X50 N019 clka clkb PHASESHIFT freq=50k  ; pins phase clk1 clk2
X§X30 N031 zda ZCD params: hys=10u  ; pins in zcd
X§X3 N028 zdb ZCD params: hys=10u  ; pins in zcd
X§X4 VM N001 N005 iNMOS params: esl=1f rsnb=1k csnb=10p ron=10m  ; pins D G S
X§X8 N005 N010 0 iNMOS params: esl=1f rsnb=1k csnb=10p ron=10m  ; pins D G S
X§X9 VM N002 Ax iNMOS params: esl=1f rsnb=1k csnb=10p ron=10m  ; pins D G S
X§X13 Ax N011 0 iNMOS params: esl=1f rsnb=1k csnb=10p ron=10m  ; pins D G S
X§X14 VM N014 Bx iNMOS params: esl=1f rsnb=1k csnb=10p ron=10m  ; pins D G S
X§X18 Bx N023 0 iNMOS params: esl=1f rsnb=1k csnb=10p ron=10m  ; pins D G S
X§X19 VM N013 N017 iNMOS params: esl=1f rsnb=1k csnb=10p ron=10m  ; pins D G S
X§X31 N017 N022 0 iNMOS params: esl=1f rsnb=1k csnb=10p ron=10m  ; pins D G S
X§X29 N009 A Ax B Bx N012 torque theta stepper_2ph params: p=50 Kt=0.4 Rw=1 Lw=2.5m J=5e-5 B=5e-3 N=100 cg1=0.05 cg3=0.015 cg5=0.005

* block symbol definitions
.subckt deadtime in l h
A1 in 0 0 0 0 0 N002 0 BUF
A2 in 0 0 0 0 0 N001 0 BUF TD={dt}
A3 0 N001 0 N002 0 0 h 0 AND
A4 0 N001 0 N002 0 l 0 0 OR
.param dt=10n
* Deadtime Generator
* deadtime(sec)
* hi-side
* lo-side
* in
* h
* l
* dt
* dt
* 2024-12-29
.ends deadtime

.subckt srff R S Q xQ
A1 R 0 0 0 0 N001 0 0 BUF
A2 0 S 0 N001 0 0 Sa 0 AND
A3 Qa 0 0 0 0 xQ 0 0 BUF
A4 Qa 0 0 0 0 0 Q 0 BUF
R1 Qa 0 1k
B1 Reff 0 V=IF({prio}==0,V(R),V(R_))
A5 S 0 0 0 0 N002 0 0 BUF
A6 0 N002 0 R 0 0 R_ 0 AND
.machine
.state LO 0
.state HI1 1
.state HI2 1
.rule LO HI1 V(Sa)>0.5
.rule HI1 HI2 V(Sa)<0.5
.rule HI2 LO V(Reff)>0.5
.output (Qa) state
.endmachine
* SR Flip-Flop
* binary
* binary
* binary
* binary
* 2025-12-29
.param prio=0
* 0: priority on R (default), 1: priority on S
* <Revision History>
* 2024-12-29: Initial version
* 2025-12-29: Added parameter "prio" to specify priority between R and S. No impact on default behaviour.
.ends srff

.subckt cmp inn inp out
R1 a 0 1k
A1 a 0 0 0 0 0 out 0 BUF
.machine
.state LO 0
.state HI 1
.rule LO HI V(inp)>(V(inn)+{hys})
.rule HI LO V(inp)<(V(inn)-{hys})
.output (a) state
.endmachine
.param hys=0
* Comparator
* hysteresis voltage
* 2024-12-29
.ends cmp

.subckt posedge in out
A2 0 in 0 N001 0 0 out 0 AND
A1 in 0 0 0 0 N001 0 0 BUF TD={td}
.param td=10n
* Positive Edge Detector
* binary
* binary
* td
* pulse width
* 2024-12-29
.ends posedge

.subckt gain in out
B1 out 0 V={G}*V(in)
.param G=1
* GAIN
* 2024-12-29
.ends gain

.subckt mux in1 in2 sel out
B1 out 0 V=IF(V(sel)>0.5,V(in1),V(in2))
* 2-1 Multiplexer
* binary
* 1: out=in1
* 0: out=in2
.ends mux

.subckt vco freq clk
C1 a 0 1
R1 b 0 1k
V2 N001 0 1
B2 a 0 I=IF(V(b),V(freq),0)
B1 N001 a I=IF(V(b),0,V(freq))
A1 b 0 0 0 0 0 clk 0 BUF
.machine
.state LO 0
.state HI 1
.rule LO HI V(a)>0.75
.rule HI LO V(a)<0.25
.output (b) state
.endmachine
.ic V(a)=0.25
* Voltage Controlled Oscillator
* frequency(Hz)
* clock
* duty 50%
* 2025-02-15
* <Revision History>
* 2024-12-29: Initial version
* 2025-02-15: Removed 1Mohm pull down resistor at freq pin to avoid large sink current.
* removed
.ends vco

.subckt counter CLK out
X§X1 CLK N015 out samplehold
X§X2 N007 CONST K={step}  ; pins K
X§X3 N008 out N009 sum
X§X4 N009 N012 N010 N011 mux
X§X5 N012 CONST K={min}  ; pins K
B1 N005 0 V=IF(V(out)<{min+step}*0.999,1,0)
B2 N002 0 V=IF(V(out)>{max}*0.999,1,0)
X§X7 N001 N006 N003 N004 mux
X§X8 N007 N004 N008 mul
X§X9 N001 CONST K=-1  ; pins K
X§X10 N006 CONST K=1  ; pins K
X§X11 N005 N002 N003 NC_01 srff params: prio=0
X§X6 N013 N005 N010 NC_02 srff params: prio=0
A1 0 N002 0 N017 0 0 N013 0 AND
X§X12 N017 CONST K={mode}  ; pins K
X§X13 N011 N016 N014 N015 mux
X§X14 N016 CONST K={init}  ; pins K
X§X15 0 CLK N014 NC_03 srff params: prio=0
.param init=0
.param min=0
.param max=256
.param step=1
.param mode=1
* Counter
* 2025-07-21
.ic V(out)={init}
* initial Value
* min value
* max value
* invrement
* 1: loopback 0: reverse
* Clock
* <Revision History>
* 2025-07-21: Initial version
.ends counter

.subckt samplehold CLK IN OUT
R1 o 0 1k
B1 OUT 0 V=V(o)
* Sample & Hold
* binary
* 2025-3-23
.machine
.state LO 0
.state LATCH 1
.state HI 2
.rule LO LATCH V(clk)>.5
.rule LATCH HI  V(clk)>.9
.rule * LO V(clk)<.5
.output (o) IF((state==1),V(in),V(out))
.endmachine
.ends samplehold

.subckt sum in1 in2 out
B1 OUT 0 V=V(IN1)+V(IN2)
* SUM
* 2024-12-29
.ends sum

.subckt mul in1 in2 out
B1 OUT 0 V=V(IN1)*V(IN2)
R1 IN1 0 1Meg
R2 IN2 0 1Meg
* Multiplier
.ends mul

.subckt stepper_2ph Tload A Ax B Bx omega Tele theta
Ra N001 A {Rw}
La N001 N002 {Lw}
Rb N005 B {Rw}
Lb N005 N006 {Lw}
B2 N006 Bx V={Kt*cos(p*V(theta))*V(omega)}
B3 Tcog 0 V={cg1*Kt*sin(N*V(theta))+cg3*Kt*sin(3*N*V(theta))+cg5*Kt*sin(5*N*V(theta))}
L§J N004 0 {J}
B5 N003 0 V=V(Tele)-V(Tload)+V(Tcog)
C1 theta 0 1
R§B N004 N003 {B}
B4 0 theta I=V(omega)
B1 N002 Ax V={Kt*sin(p*V(theta))*V(omega)}
B6 Tele 0 V={Kt*I(La)*sin(p*V(theta))+Kt*I(Lb)*cos(p*V(theta))}
B7 omega 0 V=I(J)
.param p=50
.param Rw=1
.param Lw=2.5m
.param J=5e-5
.param B=5e-4
.param Kt=0.4
.param N=100
.param cg1=0.01
.param cg3=0.003
.param cg5=0.001
* Two Phase Hybrid Stepper Motor
* 2025-09-04
.ic V(theta)=0
.ic I(J)=0
* Inertia
* Friction
.ic I(La)=0
.ic I(Lb)=0
* Number of rotor pole pairs
* Widing Resistance (ohm)
* Widing inductance (H)
* Rotor Inertia (kg・m^2)
* Rotor Friction (N・m・s/rad)
* Torque Constant (N・m/A)
* Cogging per rotation (least common multiple of 2*p and number of stator slots)
* 1st harmonic cogging torque ratio  (cogging torque amplitude divided by Kt)
* 3rd harmonic cogging torque ratio  (cogging torque amplitude divided by Kt)
* 5th harmonic cogging torque ratio  (cogging torque amplitude divided by Kt)
* <Revision History>
* 2025-07-19: Initial version
* 2025-09-04:
*   - Fixed mistake ini cogging torque formula.
*   - Replaced all IMON BV source.
*   - Reduced default cogging torque ration.
* Electrical Domain
* Mechanical Domain
.ends stepper_2ph

.tran 0 300m 0
.options solver="norm"
.options method="gear"
.param Idrv=5
.options debugtran
.param p=50
* 2 Phase Stepper Motor, 256 micro step open loop control
* Stepper Motor
* 2025.09.04
* Power Stage
* Clock
* Power
* Micro step control
* <Revision History>
* 2025-07-21: Initial version
* 2025-09-04:
*  - Reloaded updated 2PH STEPPER model.
*  - Increased rotor friction B of STEPPER to damp mechanical oscillation.
.backanno
.end